# Altium schematic sheet Sheet2.SchDoc
size A4
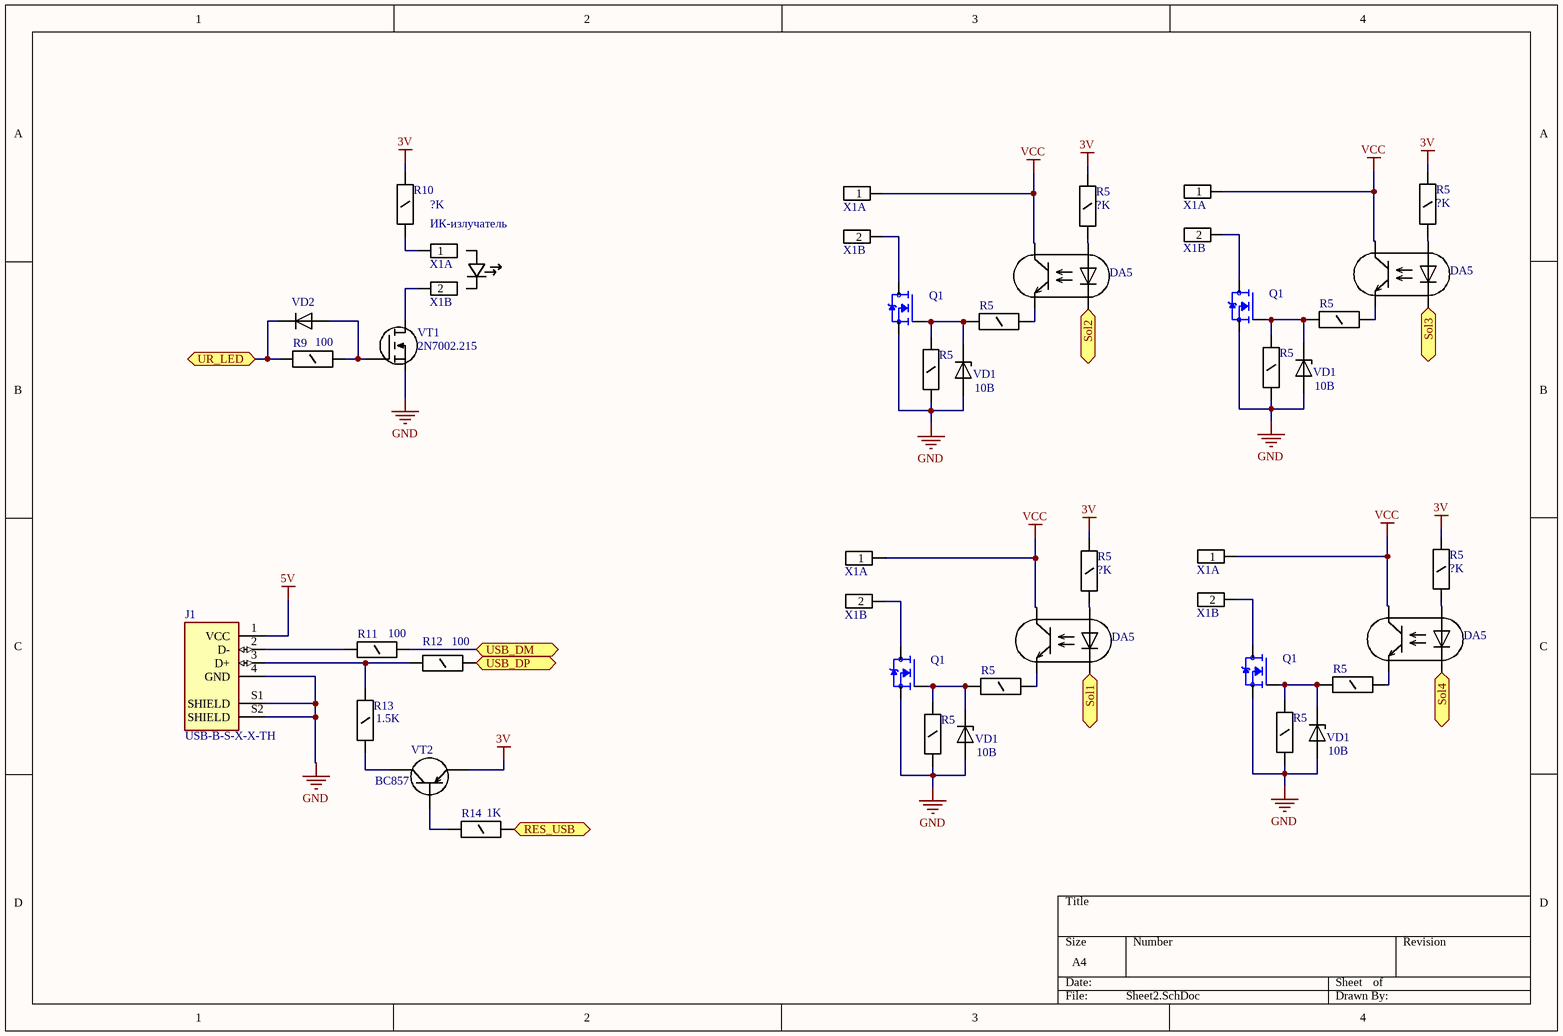
[diagram p0: Sheet2.SchDoc]

## Parts
(Parts that share a designator on the sheet are numbered #1, #2 ... from top to bottom, then left to right.)
DA5#1  KPC357NT  [Mini-flat-4]  (value not drawn)
DA5#2  KPC357NT  [Mini-flat-4]  (value not drawn)
DA5#3  KPC357NT  [Mini-flat-4]  (value not drawn)
DA5#4  KPC357NT  [Mini-flat-4]  (value not drawn)
J1  USB-B-S-X-X-TH  [SAMTEC_USB-B-S-X-X-TH]
Q1#1  IRFZ44N  [DPAK254P1524X483-3N]  (value not drawn)
Q1#2  IRFZ44N  [DPAK254P1524X483-3N]  (value not drawn)
Q1#3  IRFZ44N  [DPAK254P1524X483-3N]  (value not drawn)
Q1#4  IRFZ44N  [DPAK254P1524X483-3N]  (value not drawn)
R5#1  ?K  [R_1206]
R5#2  ?K  [R_1206]
R5#3  ?K  [R_1206]  (value not drawn)
R5#4  ?K  [R_1206]  (value not drawn)
R5#5  ?K  [R_1206]  (value not drawn)
R5#6  ?K  [R_1206]  (value not drawn)
R5#7  ?K  [R_1206]
R5#8  ?K  [R_1206]
R5#9  ?K  [R_1206]  (value not drawn)
R5#10  ?K  [R_1206]  (value not drawn)
R5#11  ?K  [R_1206]  (value not drawn)
R5#12  ?K  [R_1206]  (value not drawn)
R9  100  [R_1206]
R10  ?K  [R_1206]
R11  100  [R_1206]
R12  100  [R_1206]
R13  1.5K  [R_1206]
R14  1K  [R_1206]
VD1#1  10В  [DL-35]
VD1#2  10В  [DL-35]
VD1#3  10В  [DL-35]
VD1#4  10В  [DL-35]
VD2  SMA400*  [SMA (DO-214AC)]  (value not drawn)
VT1  2N7002.215  [SOT23]
VT2  BC857  [SOT23]
X1#1  DG508V-02  [DG508V-02]  (value not drawn)  (parts A,B of 2)
X1#2  DG508V-02  [DG508V-02]  (value not drawn)  (parts A,B of 2)
X1#3  DG508V-02  [DG508V-02]  (value not drawn)  (parts A,B of 2)
X1#4  DG508V-02  [DG508V-02]  (value not drawn)  (parts A,B of 2)
X1#5  DG508V-02  [DG508V-02]  (value not drawn)  (parts A,B of 2)

## Ports
RES_USB, Sol1, Sol2, Sol3, Sol4, UR_LED, USB_DM, USB_DP

## Nets
3V: R5#1.1 R5#2.1 R5#7.1 R5#8.1 R10.2 VT2.2(E)
5V: J1.1(VCC)
GND: J1.4(GND) J1.S1(SHIELD) J1.S2(SHIELD) Q1#1.3(S) Q1#2.3(S) Q1#3.3(S) Q1#4.3(S) R5#5.1 R5#6.1 R5#11.1 R5#12.1 VD1#1.1 VD1#2.1 VD1#3.1 VD1#4.1 VT1.2(S)
VCC: DA5#1.4 DA5#2.4 DA5#3.4 DA5#4.4 X1#1.1 X1#2.1 X1#4.1 X1#5.1
RES_USB: R14.1 ; port RES_USB
Sol1: DA5#3.2 ; port Sol1
Sol2: DA5#1.2 ; port Sol2
Sol3: DA5#2.2 ; port Sol3
Sol4: DA5#4.2 ; port Sol4
UR_LED: R9.1 VD2.K ; port UR_LED
USB_DM: R11.1 ; port USB_DM
USB_DP: R12.1 ; port USB_DP
NetDA5#1_1: DA5#1.1 R5#1.2
NetDA5#1_3: DA5#1.3 R5#3.2
NetDA5#2_1: DA5#2.1 R5#2.2
NetDA5#2_3: DA5#2.3 R5#4.2
NetDA5#3_1: DA5#3.1 R5#7.2
NetDA5#3_3: DA5#3.3 R5#9.2
NetDA5#4_1: DA5#4.1 R5#8.2
NetDA5#4_3: DA5#4.3 R5#10.2
NetJ1_2: J1.2(D-) R11.2
NetJ1_3: J1.3(D+) R12.2 R13.1
NetQ1#1_1: Q1#1.1(G) R5#3.1 R5#5.2 VD1#1.2
NetQ1#1_2: Q1#1.2(D) X1#1.2
NetQ1#2_1: Q1#2.1(G) R5#4.1 R5#6.2 VD1#2.2
NetQ1#2_2: Q1#2.2(D) X1#2.2
NetQ1#3_1: Q1#3.1(G) R5#9.1 R5#11.2 VD1#3.2
NetQ1#3_2: Q1#3.2(D) X1#4.2
NetQ1#4_1: Q1#4.1(G) R5#10.1 R5#12.2 VD1#4.2
NetQ1#4_2: Q1#4.2(D) X1#5.2
NetR9_2: R9.2 VD2.A VT1.1(G)
NetR10_1: R10.1 X1#3.1
NetR13_2: R13.2 VT2.3(K)
NetR14_2: R14.2 VT2.1(B)
NetVT1_3: VT1.3(D) X1#3.2

## Notes on the sheet
- ИК-излучатель

## Library data of the parts
DA5#1-DA5#4 = KPC357NT: оптрон, SMD; Name: KPC357NT; Mounting: SMD
J1 = USB-B-S-X-X-TH: USB-B (USB TYPE-B) USB 2.0 Receptacle Connector 4 Position Through Hole, Right Angle; MP: USB-B-S-S-B-TH; MF: Samtec; Availability: Unavailable; Package: None; SnapEDA_Link: https://www.snapeda.com/parts/USB-B-S-S-B-TH/Samtec%20Inc./view-part/230656/?ref=snap; Value: *; Price: None; Toby_UK-Purchase-URL: https://snapeda.com/shop?store=Toby+UK&id=230656
Q1#1-Q1#4 = IRFZ44NSTRRPBF: N-Channel 55V 49A (Tc) 3.8W (Ta), 94W (Tc) Surface Mount D2PAK; MF: Infineon Technologies; Availability: Bad; Value: *; Check_prices: https://www.snapeda.com/parts/IRFZ44NSTRRPBF/Infineon%20Technologies/view-part/1356646/?ref=eda; Package: D2PAK Infineon; Price: None; MP: IRFZ44NSTRRPBF; SnapEDA_Link: https://www.snapeda.com/parts/IRFZ44NSTRRPBF/Infineon%20Technologies/view-part/1356646/?ref=snap
R5#1-R5#12 R9-R14 = Резистор 1206: 0,25 Вт; Name: 1206; Power: 0.25 Вт; Tolerance: 5%; Voltage: 200В; Type: Резистор ЧИП; Mounting: SMD
  R5#1-R5#12 R10: Value: ?K
  R9 R11 R12: Value: 100
  R13: Value: 1.5K
  R14: Value: 1K
VD1#1-VD1#4 = BZV55C***: стабилитрон, SMD; Power: 0.5 Вт; Name: BZV55C***; Mounting: SMD; Voltage: 10В; Temperature range: -55 ... +175
VD2 = SMA400*: диод, SMD; Max current: 1 А; Drop voltage: 1.1 В; Name: SMA400*; Mounting: SMD; Temperature: -65 .. +175; Max voltage: ?
VT1 = 2N7002.215: MOSFET, SOT23; Type: МОП, N-канал; Package: SOT23; Name: 2N7002.215; Mounting: SMD
VT2 = BC857: PNP, SMD; Type: Биполярный PNP; Analog: KT3129; Package: SOT23; Name: BC857; Mounting: SMD
X1#1-X1#5 = DG508V-02: клеммник винтовой 2к.,5.08мм; Analog: MKDS 2/3; Name: DG508V-02; Type: шаг 5,08 мм; Mounting: в отверстие